# EAGLE design schematic (EAGLE 6.5.0)
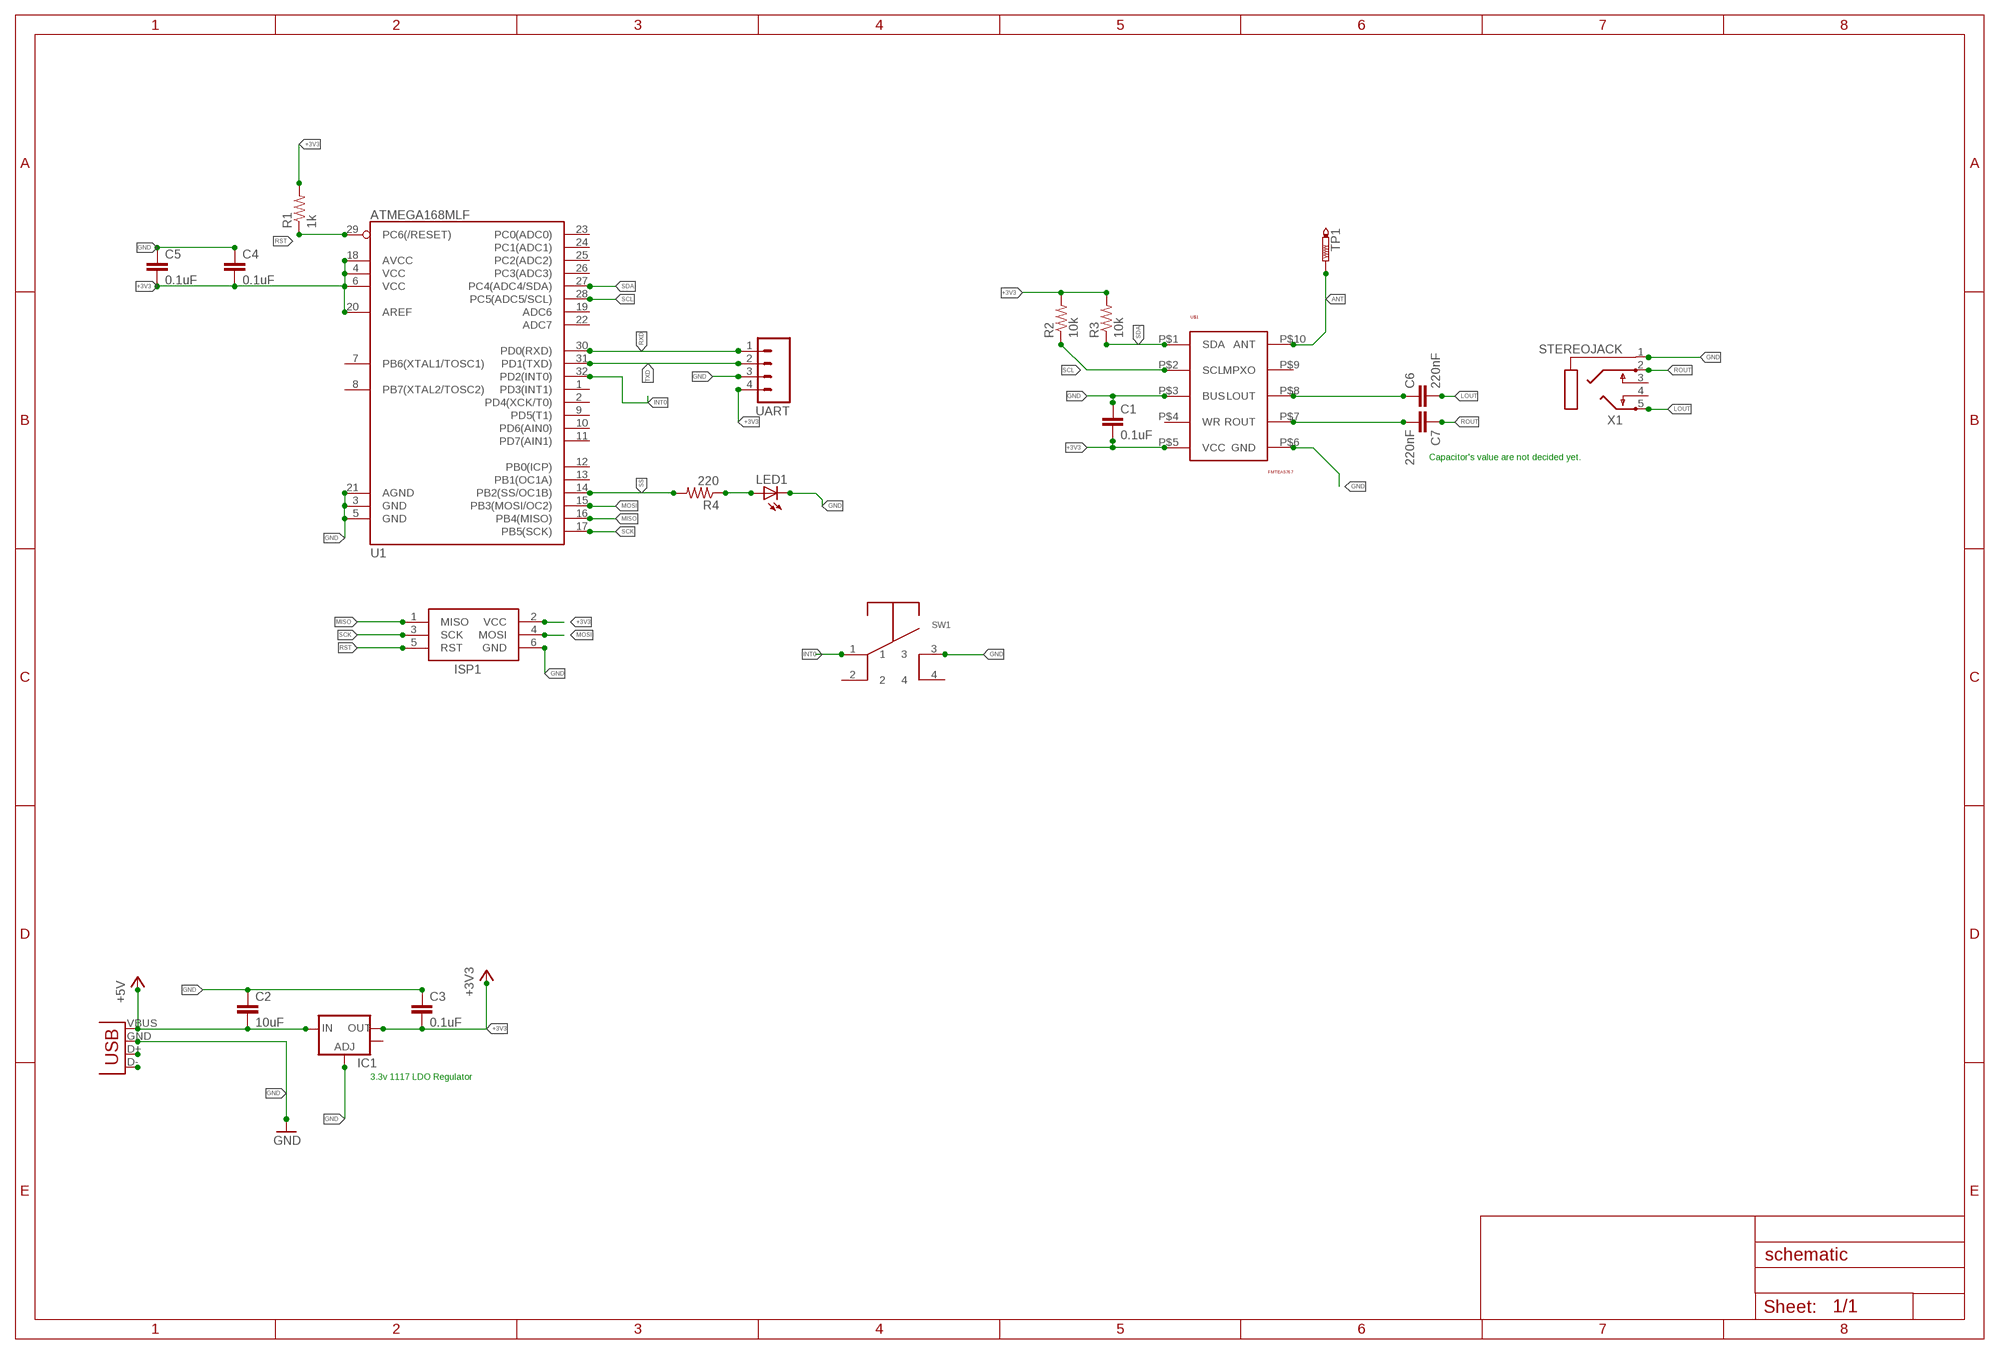
[diagram p0: schematic, sheet 1]

## Parts
C1  0.1uF  CAP0402-CAP  [0402-CAP]
C2  10uF  CAP0402-CAP  [0402-CAP]
C3  0.1uF  CAP0402-CAP  [0402-CAP]
C4  0.1uF  CAP0402-CAP  [0402-CAP]
C5  0.1uF  CAP0402-CAP  [0402-CAP]
C6  220nF  CAP0402-CAP  [0402-CAP]
C7  220nF  CAP0402-CAP  [0402-CAP]
IC1  V_REG_LM1117SOT223  [SOT223]
ISP1  AVRISP-6  [AVRISP]
JP1  USB-A-H  [USB-A-H]
LED1  LEDCHIPLED_0603  [CHIPLED_0603]
R1  1k  RESISTOR0402-RES  [0402-RES]
R2  10k  RESISTOR0402-RES  [0402-RES]
R3  10k  RESISTOR0402-RES  [0402-RES]
R4  220  RESISTOR0402-RES  [0402-RES]
SW1  TAC-SOFT  [SWITCH_SMD]
TP1  PTR1TP20SQ  [TP20SQ]
U1  ATMEGA168MLF  [MLF32]
U$1  FMTEA5767  [FMTEA5767]
UART  M04PTH  [1X04]
X1  STEREOJACK  [STX3100]

## Nets
+3V3 [PWR]: C1.2 C3.2 C4.2 C5.2 IC1.2(OUT) ISP1.2(VCC) R1.2 R2.2 R3.2 U1.4(VCC) U1.6(VCC) U1.18(AVCC) U1.20(AREF) U$1.P$5(VCC) UART.4
+5V: C2.2 IC1.3(IN) JP1.VBUS(GND)
ANT: TP1.TP U$1.P$10(ANT)
GND [PWR]: C1.1 C2.1 C3.1 C4.1 C5.1 IC1.1(ADJ) ISP1.6(GND) JP1.GND(VBUS) LED1.C SW1.3 U1.3(GND) U1.5(GND) U1.21(AGND) U$1.P$3(BUS) U$1.P$6(GND) UART.3 X1.1
INT0: SW1.1 U1.32(PD2(INT0))
LOUT: C6.2 X1.5
MISO: ISP1.1(MISO) U1.16(PB4(MISO))
MOSI: ISP1.4(MOSI) U1.15(PB3(MOSI/OC2))
N$1: JP1.D-(D+)
N$2: JP1.D+(D-)
N$4: C6.1 U$1.P$8(LOUT)
N$5: LED1.A R4.1
N$8: C7.2 U$1.P$7(ROUT)
ROUT: C7.1 X1.2
RST: ISP1.5(RST) R1.1 U1.29(PC6(/RESET))
RXD: U1.30(PD0(RXD)) UART.1
SCK: ISP1.3(SCK) U1.17(PB5(SCK))
SCL: R2.1 U1.28(PC5(ADC5/SCL)) U$1.P$2(SCL)
SDA: R3.1 U1.27(PC4(ADC4/SDA)) U$1.P$1(SDA)
SS: R4.2 U1.14(PB2(SS/OC1B))
TXD: U1.31(PD1(TXD)) UART.2
Unconnected: IC1.4(OUT) SW1.2 SW1.4 U1.1(PD3(INT1)) U1.2(PD4(XCK/T0)) U1.7(PB6(XTAL1/TOSC1)) U1.8(PB7(XTAL2/TOSC2)) U1.9(PD5(T1)) U1.10(PD6(AIN0)) U1.11(PD7(AIN1)) U1.12(PB0(ICP)) U1.13(PB1(OC1A)) U1.19(ADC6) U1.22(ADC7) U1.23(PC0(ADC0)) U1.24(PC1(ADC1)) U1.25(PC2(ADC2)) U1.26(PC3(ADC3)) U$1.P$4(WR) U$1.P$9(MPXO) X1.3 X1.4

## Notes on the sheet
- Capacitor's value are not decided yet.
- 3.3v 1117 LDO Regulator

## Library data of the parts
C1-C7 = weatherpilot_lbr:CAP: Capacitor Standard 0603 ceramic capacitor, and 0.1" leaded capacitor.
IC1 = SparkFun-PowerIC:V_REG_LM1117: Voltage Regulator LM1117 Standard adjustable voltage regulator but in SMD form. Spark Fun Electronics SKU : COM-00595
ISP1 = adafruit:AVRISP: AVR ISP HEADER Standard 6 pin header for AVR programming
JP1 = SparkFun-Connectors:USB: USB Connectors USB-B-PTH is fully proven SKU : PRT-00139/CONN-08278 USB-miniB is fully proven SKU : PRT-00587 USB-A-PCB is untested. USB-A-H is throughly reviewed, but untested. Spark Fun Electronics SKU : PRT-00437 USB-B-SMT is throughly reviewed, but untested. Needs silkscreen touching up. USB-A-S has not been used/tested USB-MB-H has not been used/tested USB-MICROB has been used. CONN-09505
LED1 = led:LED: LED OSRAM: - CHIPLED LG R971, LG N971, LY N971, LG Q971, LY Q971, LO R971, LY R971 LH N974, LH R974 LS Q976, LO Q976, LY Q976 LO Q996 - Hyper CHIPLED LW Q18S LB Q993, LB Q99A, LB R99A - SideLED LS A670, LO A670, LY A670, LG A670, LP A670 LB A673, LV A673, LT A673, LW A673 LH A674 LY A675 LS A676, LA A676, LO A676, LY A676, LW A676 LS A679, LY A679, LG A679 - Hyper Micro SIDELED® LS Y876, LA Y876, LO Y876, LY Y876 LT Y87S - SmartLED LW L88C, LW L88S LB L89C, LB L89S, LG L890 LS L89K, LO L89K, LY L89K LS L896, LA L896, LO L896, LY L896 - TOPLED LS T670, LO T670, LY T670, LG T670, LP T670 LSG T670, LSP T670, LSY T670, LOP T670, LYG T670 LG T671, LOG T671, LSG T671 LB T673, LV T673, LT T673, LW T673 LH T674 LS T676, LA T676, LO T676, LY T676, LB T676, LH T676, LSB T676, LW T676 LB T67C, LV T67C, LT T67C, LS T67K, LO T67K, LY T67K, LW E67C LS E67B, LA E67B, LO E67B, LY E67B, LB E67C, LV E67C, LT E67C LW T67C LS T679, LY T679, LG T679 LS T770, LO T770, LY T770, LG T770, LP T770 LB T773, LV T773, LT T773, LW T773 LH T774 LS E675, LA E675, LY E675, LS T675 LS T776, LA T776, LO T776, LY T776, LB T776 LHGB T686 LT T68C, LB T68C - Hyper Mini TOPLED® LB M676 - Mini TOPLED Santana® LG M470 LS M47K, LO M47K, LY M47K Source: http://www.osram.convergy.de LUXEON: - LUMILED® LXK2-PW12-R00, LXK2-PW12-S00, LXK2-PW14-U00, LXK2-PW14-V00 LXK2-PM12-R00, LXK2-PM12-S00, LXK2-PM14-U00 LXK2-PE12-Q00, LXK2-PE12-R00, LXK2-PE12-S00, LXK2-PE14-T00, LXK2-PE14-U00 LXK2-PB12-K00, LXK2-PB12-L00, LXK2-PB12-M00, LXK2-PB14-N00, LXK2-PB14-P00, LXK2-PB14-Q00 LXK2-PR12-L00, LXK2-PR12-M00, LXK2-PR14-Q00, LXK2-PR14-R00 LXK2-PD12-Q00, LXK2-PD12-R00, LXK2-PD12-S00 LXK2-PH12-R00, LXK2-PH12-S00 LXK2-PL12-P00, LXK2-PL12-Q00, LXK2-PL12-R00 Source: www.luxeon.com KINGBRIGHT: KA-3528ASYC Source: www.kingbright.com
R1-R4 = weatherpilot_lbr:RESISTOR: Resistor Basic schematic elements and footprints for 0603, 1206, and PTH resistors.
SW1 = libraryPart:TAC-SOFT: Soft Switch P12932SCT-ND
TP1 = testpad:PTR1: TEST PIN
U1 = SparkFun-DigitalIC:ATMEGA168: Atmel 32-pin 8-bit micro, 16k flash.
U$1 = library:FMTEA5767
UART = SparkFun-Connectors:M04: Header 4 Standard 4-pin 0.1" header. Use with straight break away headers (SKU : PRT-00116), right angle break away headers (PRT-00553), swiss pins (PRT-00743), machine pins (PRT-00117), and female headers (PRT-00115). Molex polarized connector foot print use with SKU : PRT-08231 with associated crimp pins and housings. 1MM SMD Version SKU: PRT-10208
X1 = adafruit:STEREOJACK: MIC/HEADPHONE JACK Stereo jack with two switches. Kycon STX3100, CUI SJ1-3555NG and/or 4UCon 05544

## Net classes
0 default: width 0.152 mm, drill 0.305 mm, clearance 0.152 mm
1 PWR: width 0.203 mm, drill 0.305 mm, clearance 0.152 mm

## Board
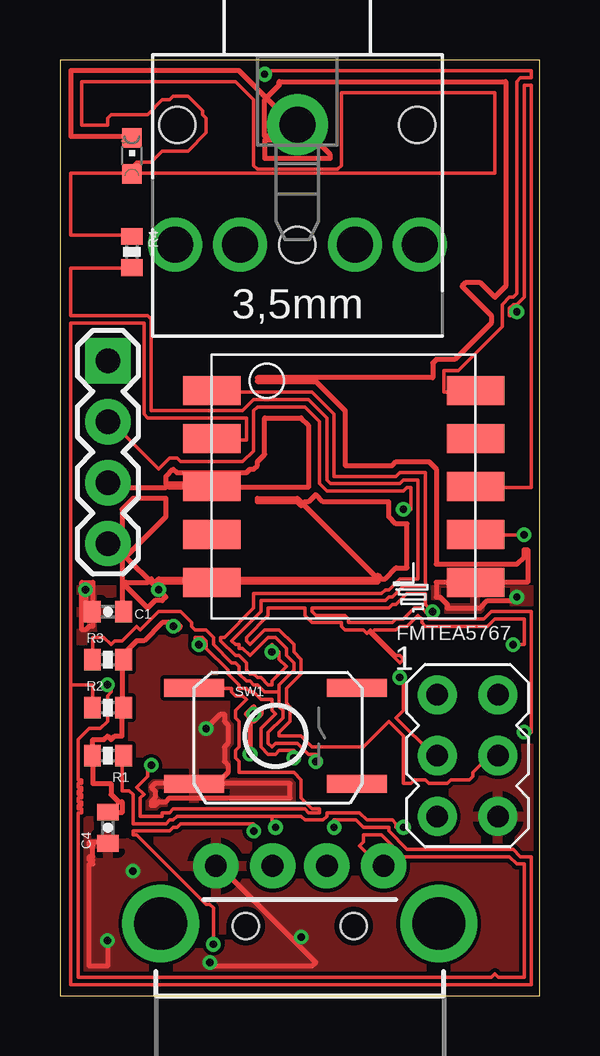
[diagram p1: board, top side]
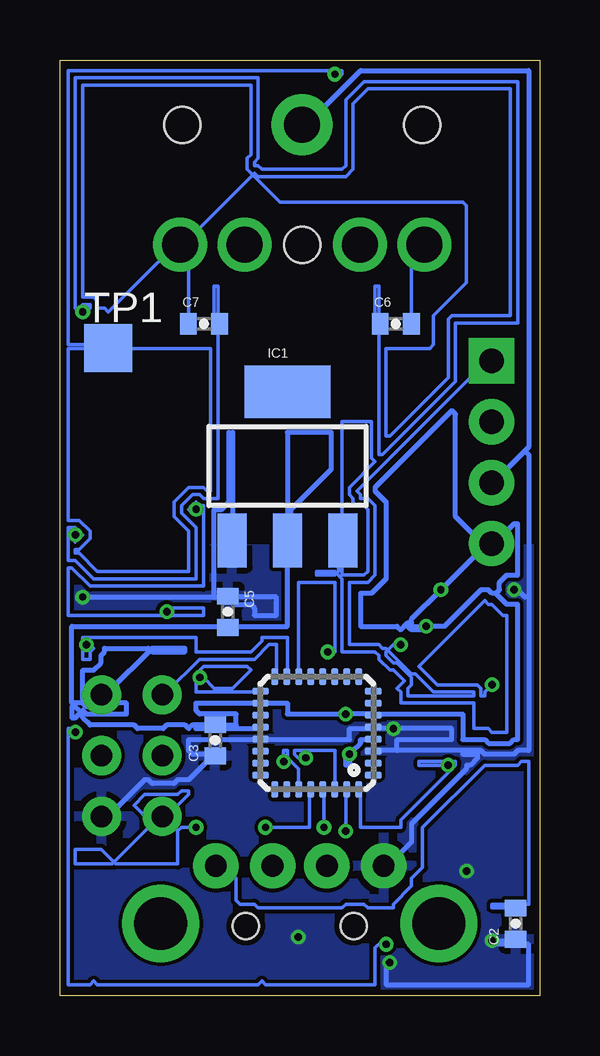
[diagram p2: board, bottom side, seen from below]

Size 20 x 39 mm. Coordinates in mm from the lower left corner, seen from the top.
Outline: 0,0 20,0 20,39 0,39 0,0
Copper layers (1*16): Top 0.035mm / dielectric 1.5mm / Bottom 0.035mm
Design rules "smart prototyping": minimum track width 6mil, minimum drill 12mil, track to track 6mil, track to pad 6mil, pad to pad 6mil, via to via 6mil, smd to smd 0mil, copper to edge 10mil, drill to drill 10mil, minimum pad ring 6mil, minimum via ring 6mil, stop-mask expansion 2mil, vias tented up to drill 25mil, thermal gap 10mil

### Footprints (pad centres in the part's own frame; a part is rotated, then mirrored left to right if it is on the bottom)
0402-CAP = smd 0.7 x 0.9: 1 -0.65,0; 2 0.65,0
SOT223 = smd 1.219 x 2.235: 1 -2.311,-3.099; 2 0,-3.099; 3 2.311,-3.099 | smd 3.6 x 2.2: 4 0,3.099
AVRISP = drill 0.9 pad 1.626: 1 -1.27,2.54; 2 1.27,2.54; 3 -1.27,0; 4 1.27,0; 5 -1.27,-2.54; 6 1.27,-2.54
USB-A-H = drill 0.914 pad 1.88: D+ 2.4,1.127; D- 2.4,-1.127; GND 2.4,3.5; VBUS 2.4,-3.5 | drill 2.2: GND2 0,-5.8; GND3 0,5.8 | hole 1.1: -0.1,2.25; -0.1,-2.25
CHIPLED_0603 = smd 0.8 x 0.8: A 0,-0.75; C 0,0.75
0402-RES = smd 0.7 x 0.9: 1 -0.65,0; 2 0.65,0
SWITCH_SMD = smd 2.5 x 0.762: 1 -3.4,2; 2 3.4,2; 3 -3.4,-2; 4 3.4,-2
TP20SQ = smd 2 x 2: TP 0,0
MLF32 = smd 0.7 x 0.3: 1 -2.35,1.75; 2 -2.35,1.25; 3 -2.35,0.75; 4 -2.35,0.25; 5 -2.35,-0.25; 6 -2.35,-0.75; 7 -2.35,-1.25; 8 -2.35,-1.75; 17 2.35,-1.75; 18 2.35,-1.25; 19 2.35,-0.75; 20 2.35,-0.25; 21 2.35,0.25; 22 2.35,0.75; 23 2.35,1.25; 24 2.35,1.75 | smd 0.3 x 0.7: 9 -1.75,-2.35; 10 -1.25,-2.35; 11 -0.75,-2.35; 12 -0.25,-2.35; 13 0.25,-2.35; 14 0.75,-2.35; 15 1.25,-2.35; 16 1.75,-2.35; 25 1.75,2.35; 26 1.25,2.35; 27 0.75,2.35; 28 0.25,2.35; 29 -0.25,2.35; 30 -0.75,2.35; 31 -1.25,2.35; 32 -1.75,2.35
FMTEA5767 = smd 2.4 x 1.2: P$1 0,-1.5; P$2 0,-3.5; P$3 0,-5.5; P$4 0,-7.5; P$5 0,-9.5; P$6 11,-9.5; P$7 11,-7.5; P$8 11,-5.5; P$9 11,-3.5; P$10 11,-1.5
1X04 = drill 1.016 pad 1.88 square: 1 0,0 | drill 1.016 pad 1.88: 2 2.54,0; 3 5.08,0; 4 7.62,0
STX3100 = drill 1.5 pad 2.54: 1 2.7,-0.1 | drill 1.5: 2 7.7,5; 3 7.7,2.3; 4 7.7,-2.5; 5 7.7,-5.2 | hole 1.5: 2.7,4.9; 2.7,-5.1; 7.7,-0.1

### Placement (x,y rotation side)
C1  2,16 0 top
C2  1,3 90 bottom
C3  13.52,10.64 90 bottom
C4  2,7 90 top
C5  13,16 270 bottom
C6  6,28 0 bottom
C7  14,28 0 bottom
IC1  10.51,22.07 0 bottom
ISP1  17,10 0 top
JP1  10,3 90 top
LED1  3,35 0 top
R1  2,10 180 top
R2  2,12 0 top
R3  2,14 0 top
R4  3,31 270 top
SW1  8.99,10.82 0 top
TP1  18,27 0 bottom
U1  9.29,10.95 180 bottom
U$1  6.33,26.72 0 top
UART  2,26.46 270 top
X1  10,39 270 top

### Tracks (layer width: path | path; a pad name or v marks a point on that pad's centre or on a via)
+3V3  (via drill 0.3)
  Top 0.203: C1.2 2.59,16 2.59,20.27 3.05,20.73 4.42,20.73 4.42,19.96 2.74,18.29 3.96,17.07 4.12,17.22 6.25,17.22 U$1.P$5 6.4,17.22 13.26,17.22 13.26,17.37 9.91,20.73 8.23,20.73 8.23,20.57 9.91,20.57 10.06,20.42 10.21,20.57 10.36,20.57 10.67,20.88 10.97,20.57 13.72,20.57 13.72,19.96 14.02,19.66 14.48,19.66 14.48,17.83 14.02,17.83 13.56,17.37 13.41,17.37 13.26,17.53 13.11,17.37 4.12,17.37 3.96,17.22 3.81,17.37 3.66,17.22 2.74,17.22 2.74,17.07 3.66,16.15 3.96,16.46 4.27,16.46 4.42,16.61 v4.12,16.92 | C4.2 2.13,7.62 2.59,7.62 2.59,8.08 2.44,8.08 2.13,8.38 2.13,8.84 1.37,8.84 1.37,9.91 R1.2 1.37,10.06 1.37,10.67 1.83,10.67 1.98,10.82 2.13,10.67 2.29,10.82 2.59,10.82 2.59,11.89 R2.2 2.59,12.04 2.59,13.87 R3.2 2.59,14.02 2.59,14.33 2.74,14.33 3.2,14.78 3.5,14.78 4.27,15.54 4.88,15.54 5.03,15.39 4.88,15.24 v4.72,15.39 | v7.92,10.06 7.92,11.43 8.08,11.43 8.38,11.73 8.38,11.89 8.23,11.89 8.08,12.04 7.77,11.73 7.92,11.58 v8.08,11.73
  Bottom 0.203: IC1.2 10.52,19.05 10.52,23.47 8.69,23.47 8.69,21.95 10.36,20.27 10.36,19.2 10.21,19.05 10.21,18.9 10.36,18.75 10.52,18.75 10.52,15.39 12.95,15.39 C5.2 13.11,15.39 19.51,15.39 19.51,12.19 19.05,12.19 18.9,12.04 18.44,12.5 18.29,12.5 ISP1.2 18.14,12.65 17.98,12.65 16.15,14.48 14.78,14.48 14.78,14.33 16.15,14.33 16.31,14.48 18.14,14.48 18.14,14.33 18.29,14.17 18.29,13.87 18.59,13.56 19.05,13.56 19.05,12.34 18.9,12.19 18.75,12.34 18.59,12.19 17.22,12.19 17.22,11.73 18.9,11.73 19.05,11.89 19.36,11.58 19.51,11.58 19.51,12.04 19.36,12.04 19.05,11.73 19.05,11.58 18.75,11.28 16.92,11.28 16.76,11.12 15.7,11.12 15.54,11.28 14.78,11.28 14.63,11.12 14.48,11.28 14.33,11.28 | v7.92,10.06 7.92,9.6 8.08,9.6 8.08,10.21 7.77,10.21 7.47,10.52 7.47,10.67 7.01,10.67 U1.4 | 14.33,11.28 14.33,11.12 11.73,11.12 U1.20 | 14.33,11.28 13.56,11.28 C3.2 13.41,11.28 12.65,11.28 12.65,11.73 14.17,11.73 14.33,11.89 14.33,12.19 11.73,12.19 U1.18 11.58,12.19 10.52,12.19 10.52,11.73 v8.08,11.73 7.01,11.73 U1.6 6.86,11.73 3.2,11.73 3.2,10.67 2.29,10.67 2.13,10.52 1.22,10.52 1.07,10.67 0.91,10.67 0.91,16.31 1.37,16.31 1.83,16.76 | v4.72,15.39 5.33,15.39 5.49,15.54 5.79,15.24 5.94,15.39 7.47,15.39 7.47,16.76 7.01,16.76 6.4,17.37 6.4,20.57 6.86,21.03 6.86,21.18 3.66,24.38 3.5,24.23 3.5,19.96 2.29,18.75 v4.12,16.92 5.33,15.7 5.33,15.54 5.49,15.39 5.33,15.24 4.72,15.24 4.57,15.39 3.96,15.39 2.44,16.92 2.13,16.92 1.98,16.76 1.83,16.76 | 1.83,16.76 1.68,16.92 1.68,17.22 1.37,17.53 0.91,17.53 0.91,19.66 1.07,19.66 1.83,18.9 1.98,18.9 UART.4
+5V  (via drill 0.3)
  Top 0.152: v1.98,12.95 2.13,12.8 2.13,12.65 1.98,12.5 1.98,11.43 1.68,11.12 1.22,11.12 0.76,10.67 0.76,8.99 0.91,8.99 0.91,8.84 0.76,8.84 0.76,8.69 0.91,8.69 0.91,8.53 0.76,8.53 0.76,8.38 0.91,8.38 0.91,8.23 0.76,8.23 0.76,8.08 0.91,8.08 0.91,7.92 0.76,7.92 0.76,7.77 0.91,7.77 0.91,7.62 0.76,7.62 0.76,0.76 17.98,0.76 18.14,0.91 18.29,0.76 19.36,0.76 19.36,5.49 19.05,5.49 18.75,5.79 14.33,5.79 13.41,6.71 12.65,6.71 12.65,6.4 12.5,6.25 13.26,5.49 13.41,5.49 JP1.VBUS
  Bottom 0.152: C2.2 1.07,3.66 1.98,3.66 1.98,3.81 0.46,3.81 0.46,9.75 0.76,9.75 0.91,9.6 2.29,9.6 4.88,7.01 4.88,5.33 5.33,4.88 5.33,4.57 6.1,3.81 6.1,3.66 7.16,3.66 7.32,3.81 8.08,3.81 8.23,3.66 11.73,3.66 11.89,3.81 12.5,3.81 12.65,3.96 12.65,4.88 13.26,5.49 13.41,5.49 JP1.VBUS | v1.98,12.95 2.29,12.65 2.29,12.5 2.44,12.5 2.44,12.8 2.59,12.95 4.27,12.95 5.03,13.72 2.29,16.46 2.13,16.31 1.98,16.31 1.52,15.85 1.37,15.85 1.37,10.97 1.98,10.97 2.13,11.12 2.74,11.12 2.74,12.19 5.79,12.19 5.79,12.65 5.94,12.8 5.64,13.11 6.1,13.56 6.25,13.56 6.71,14.02 6.71,14.17 6.86,14.33 8.23,14.33 8.23,17.37 8.53,17.68 9.3,17.68 9.3,17.53 8.53,17.53 8.38,17.68 8.38,18.75 8.23,18.75 8.23,17.53 7.32,17.53 7.16,17.68 7.16,20.27 7.32,20.42 7.62,20.42 7.77,20.57 7.77,20.73 7.92,20.88 7.92,21.18 6.86,22.25 7.01,22.4 7.01,23.93 8.23,23.93 8.23,19.05 IC1.3
ANT  (via drill 0.3)
  Top 0.152: v8.53,38.41 8.53,38.56 19.66,38.56 19.66,38.25 19.2,38.25 19.05,38.1 19.05,29.26 18.9,29.11 18.75,29.11 18.44,28.8 18.44,27.89 16.61,26.06 16,26.06 16,25.15 17.22,25.15 U$1.P$10
  Bottom 0.152: v8.53,38.41 8.38,38.25 8.23,38.41 8.23,38.56 19.66,38.56 19.66,27.13 18.29,27.13 18.29,26.98 19.66,26.98 19.66,19.81 19.2,19.81 18.75,19.36 18.75,19.05 19.2,18.59 19.36,18.59 19.36,18.44 19.2,18.44 18.44,17.68 14.63,17.68 14.63,19.36 15.24,19.96 15.24,20.57 14.63,21.18 14.02,21.18 13.87,21.03 13.72,21.03 13.72,26.98 17.98,26.98 TP1.TP
GND  (via drill 0.3)
  Top 0.203: v6.25,1.37 6.4,1.22 10.52,1.22 10.67,1.37 6.71,5.33 6.55,5.33 JP1.GND | v1.98,2.29 1.98,1.22 1.22,1.22 1.22,5.49 1.37,5.49 1.37,5.64 1.22,5.64 1.22,5.79 1.37,5.79 1.37,6.25 1.22,6.25 1.22,6.4 1.98,6.4 C4.1 | U$1.P$3 6.4,21.18 10.36,21.18 10.36,23.77 10.06,24.08 8.53,24.08 8.53,22.55 8.23,22.25 8.23,22.1 8.08,21.95 7.92,21.95 7.77,21.79 4.88,21.79 4.72,21.95 4.42,21.64 4.42,21.34 4.57,21.18 6.1,21.18 6.1,21.34 4.57,21.34 4.42,21.18 2.74,21.18 2.59,21.03 2.29,21.34 2.13,21.34 UART.3 | v19.05,16.61 19.05,16.46 17.83,16.46 17.53,16.15 16.15,16.15 16.15,16.31 15.85,16.61 15.7,16.61 15.7,17.22 17.22,17.22 U$1.P$6 17.37,17.22 19.51,17.22 19.51,18.59 19.36,18.59 19.36,18.29 19.05,17.98 15.7,17.98 15.7,21.95 15.39,22.25 14.02,22.25 13.87,22.1 11.89,22.1 11.89,24.38 10.67,25.6 8.23,25.6 8.23,25.76 15.54,25.76 15.54,26.36 15.7,26.52 16.46,26.52 17.98,28.04 17.98,28.35 16.76,29.57 16.92,29.72 17.53,29.72 18.14,29.11 18.59,29.57 18.59,38.1 9.14,38.1 9.14,37.95 8.53,37.34 8.53,35.81 10.21,35.81 10.36,35.97 11.28,35.05 11.28,34.9 8.53,34.9 8.53,35.66 10.21,35.66 10.36,35.81 10.21,35.97 10.21,36.12 10.06,36.27 9.91,36.27 X1.1 9.75,36.42 9.6,36.42 7.47,38.56 0.46,38.56 0.46,35.81 2.9,35.81 LED1.C | v1.07,16.92 1.07,15.85 1.22,15.7 1.37,15.7 1.37,15.39 1.22,15.39 1.07,15.24 0.91,15.24 0.91,17.22 1.37,17.22 1.37,16 C1.1 | v6.1,11.12 6.71,11.73 6.86,11.73 6.86,11.43 7.01,11.28 7.01,10.52 6.86,10.36 6.86,9.75 7.01,9.6 7.01,9.3 6.71,8.99 5.49,8.99 5.33,8.84 3.96,8.84 3.81,8.69 3.96,8.53 3.96,8.23 3.81,8.08 3.81,7.92 3.96,7.92 4.12,8.08 4.42,8.08 4.57,8.23 9.6,8.23 9.6,8.84 5.64,8.84 SW1.3
  Bottom 0.203: ISP1.6 18.14,7.47 17.98,7.47 16.46,8.99 16.31,8.99 16.15,8.84 15.24,8.84 15.09,8.99 14.63,8.99 13.72,9.91 13.56,9.91 C3.1 13.56,10.06 14.48,10.06 14.63,10.21 14.63,10.67 11.73,10.67 U1.21 11.58,10.67 7.92,10.67 7.92,11.12 7.01,11.12 U1.5 6.86,11.12 v6.1,11.12 3.66,11.12 3.66,10.67 5.94,10.67 5.94,10.21 | v6.25,1.37 6.4,1.37 6.4,0.46 0.46,0.46 0.46,2.13 1.98,2.13 v1.98,2.29 1.07,2.29 C2.1 | v19.05,16.61 13.56,16.61 | 13.56,16.61 13.26,16.61 13.11,16.46 12.8,16.46 12.8,16.31 12.04,16.31 11.89,16.15 11.89,15.85 10.97,15.85 10.97,16.61 12.95,16.61 C5.1 | 13.56,16.61 13.56,20.27 13.26,20.27 12.95,20.57 12.95,23.47 12.8,23.47 12.8,19.05 IC1.1 | 3.2,10.21 2.44,10.21 2.29,10.06 1.07,10.06 0.91,10.21 0.46,10.21 0.46,16.61 | 3.2,10.21 5.94,10.21 | 5.94,10.21 6.86,10.21 U1.3 | 0.46,16.61 0.46,22.55 0.61,22.71 | 0.61,22.71 0.46,22.86 0.46,38.56 7.47,38.56 9.6,36.42 9.75,36.42 X1.1 | v1.07,16.92 1.07,16.76 0.76,16.76 0.61,16.61 0.46,16.61 | 0.61,22.71 1.83,21.49 1.98,21.49 UART.3 | 3.2,10.21 3.2,10.06 2.59,10.06 2.59,9.91 2.9,9.6 3.05,9.6 3.05,9.45 5.33,7.16 5.33,6.4 6.25,5.49 6.4,5.49 JP1.GND
  other vias: 3.05,5.18 10.06,2.44
  pour Top (isolate 0.152): -9.6,16.92 28.04,16.92 28.04,-2.29 -9.6,-2.29
  pour Bottom (isolate 0.152): -5.33,18.59 23.62,18.59 23.62,-1.37 -5.33,-1.37
INT0  (via drill 0.3)
  Top 0.152: v3.81,9.6 3.66,9.45 3.66,9.14 3.2,8.69 3.5,8.38 3.35,8.23 3.35,7.47 4.27,7.47 4.27,7.62 4.57,7.62 4.72,7.77 10.21,7.77 10.36,7.62 10.82,7.62 10.82,7.77 10.52,7.77 10.06,8.23 10.06,8.99 9.75,9.3 7.47,9.3 7.47,9.75 7.32,9.91 7.32,10.21 7.47,10.36 7.47,11.43 7.32,11.58 7.32,11.89 7.77,12.34 7.62,12.5 7.32,12.5 7.16,12.65 7.16,12.8 5.64,12.8 SW1.1
  Bottom 0.152: v3.81,9.6 5.03,9.6 5.03,9.75 3.5,9.75 3.5,9.6 5.79,7.32 5.79,7.01 7.47,7.01 7.47,8.53 U1.32
LOUT
  Bottom 0.152: C6.2 5.33,28.04 5.33,30.63 5.49,30.79 5.03,31.24 4.88,31.24 X1.5
MISO
  Bottom 0.152: U1.16 10.97,13.41 10.97,14.63 11.28,14.63 11.89,14.02 14.17,14.02 15.54,12.65 15.7,12.65 ISP1.1
MOSI  (via drill 0.3)
  Top 0.152: v18.9,14.63 19.36,14.63 19.36,15.7 18.14,15.7 17.83,15.39 15.24,15.39 15.09,15.54 15.09,15.7 14.94,15.85 14.48,15.39 14.17,15.39 14.02,15.24 13.11,15.24 12.95,15.09 14.17,13.87 14.33,14.02 14.17,14.17 14.02,14.17 12.95,15.24 12.8,15.09 12.65,15.24 11.89,15.24 11.73,15.39 11.73,15.54 10.52,15.54 10.21,15.85 10.21,16.15 8.69,16.15 8.69,15.85 7.77,14.94 7.77,14.78 7.92,14.63 8.53,15.24 9.14,15.24 9.75,14.63 9.75,14.33 10.06,14.02 10.06,13.41 9.45,12.8 9.45,12.19 9.6,12.04 9.6,11.43 9.14,10.97 9.14,10.82 10.06,10.82 10.52,10.36 12.65,10.36 13.72,11.43 14.33,10.82 14.33,8.84 14.63,8.84 14.78,8.99 15.24,8.99 15.39,8.84 16.15,8.84 16.31,8.99 17.07,8.99 17.22,9.14 17.22,9.3 17.98,10.06 18.14,10.06 ISP1.4
  Bottom 0.152: v18.9,14.63 18.75,14.63 18.59,14.48 18.75,14.33 18.75,14.02 19.05,14.02 19.05,14.94 14.33,14.94 14.33,14.33 12.04,14.33 11.58,14.78 11.58,14.94 10.52,14.94 10.52,13.41 U1.15
N$4  (via drill 0.3)
  Top 0.152: v19.05,28.5 18.9,28.35 18.75,28.35 18.75,28.65 18.9,28.8 19.05,28.8 19.36,29.11 19.36,37.95 19.66,37.95 19.66,21.18 17.37,21.18 U$1.P$8
  Bottom 0.152: v19.05,28.5 18.9,28.65 18.75,28.65 18.75,28.8 19.05,28.8 19.2,28.65 19.36,28.65 19.36,38.25 11.73,38.25 11.73,34.9 11.89,34.75 11.89,34.59 11.73,34.59 11.58,34.44 8.23,34.44 8.08,34.59 8.08,37.34 7.32,38.1 0.91,38.1 0.91,28.04 3.5,28.04 3.5,25.6 6.55,22.55 6.71,22.55 6.71,27.74 6.86,27.89 6.86,29.57 6.71,29.57 6.71,28.04 C6.1
N$5
  Top 0.152: LED1.A 3.05,34.29 18.14,34.29 18.14,37.64 11.73,37.64 11.73,34.59 11.58,34.44 8.23,34.44 8.08,34.59 8.08,37.34 7.32,38.1 0.91,38.1 0.91,36.27 1.98,36.27 1.98,36.58 2.13,36.73 3.66,36.73 4.27,37.34 4.57,37.34 4.72,37.49 5.33,37.49 5.94,36.88 5.94,36.73 6.1,36.58 6.1,35.97 5.33,35.2 4.27,35.2 3.81,34.75 3.2,34.75 2.74,34.29 0.46,34.29 0.46,31.7 2.9,31.7 R4.1
N$8  (via drill 0.3)
  Top 0.152: v19.36,19.2 17.37,19.2 U$1.P$7
  Bottom 0.152: v19.36,19.2 19.51,19.05 19.36,18.9 19.05,19.2 19.36,19.51 19.66,19.51 19.66,18.14 19.36,18.14 18.59,17.37 14.33,17.37 14.33,19.51 14.94,20.12 14.94,20.42 14.48,20.88 14.17,20.88 14.02,20.73 13.41,20.73 13.41,27.74 13.56,27.89 13.56,29.57 13.41,29.57 13.41,28.04 C7.2
ROUT
  Bottom 0.152: C7.1 14.63,28.04 14.63,31.24 14.78,31.39 11.89,34.29 11.73,34.14 8.08,34.14 7.77,34.44 7.77,37.19 7.16,37.8 1.22,37.8 1.22,28.35 3.66,28.35 3.81,28.19 3.81,25.76 6.25,23.32 6.4,23.32 6.4,26.98 4.57,26.98 4.42,27.13 4.42,28.35 3.05,29.72 3.05,32.92 3.2,33.07 10.82,33.07 12.19,34.44 12.19,34.9 12.04,35.05 12.04,37.95 19.05,37.95 19.05,29.11 18.59,29.11 18.44,28.96 18.44,28.65 18.14,28.65 17.98,28.5 15.24,31.24 15.09,31.24 X1.2
RST  (via drill 0.3)
  Top 0.152: v8.99,7.01 8.84,7.16 8.84,7.47 | 8.84,7.47 4.88,7.47 4.72,7.32 4.57,7.32 4.42,7.16 3.05,7.16 3.05,8.38 2.9,8.53 2.59,8.53 2.59,9.91 R1.1 | v14.33,7.01 14.02,7.01 14.02,7.16 13.87,7.32 12.8,7.32 12.5,7.62 11.12,7.62 11.12,7.47 10.97,7.32 10.21,7.32 10.06,7.47 8.84,7.47
  Bottom 0.152: v8.99,7.01 8.99,8.53 U1.29 | v14.33,7.01 14.94,7.01 15.09,6.86 15.09,5.49 17.68,5.49 18.29,6.1 19.36,6.1 19.36,5.49 17.83,5.49 16.15,7.16 16.92,7.92 16.46,8.38 15.09,8.38 14.94,8.53 14.63,8.53 14.63,8.38 15.54,7.47 15.7,7.47 ISP1.5
RXD  (via drill 0.3)
  Top 0.152: v9.75,9.91 9.91,10.06 9.75,10.21 9.14,10.21 8.99,10.06 8.69,10.06 8.38,10.36 8.38,11.12 8.99,11.73 8.84,11.89 8.84,12.34 8.38,12.34 8.08,12.65 7.92,12.65 7.77,12.8 7.47,12.8 7.47,12.95 7.01,13.41 7.01,13.56 6.1,14.48 6.1,14.78 5.94,14.94 5.64,14.94 5.64,14.78 v5.79,14.63
  Bottom 0.152: v9.75,9.91 9.91,9.75 10.21,10.06 10.21,10.21 8.53,10.21 8.53,8.69 U1.30 | v5.79,14.63 6.1,14.63 6.4,14.33 6.4,14.17 6.1,13.87 5.94,13.87 5.33,13.26 5.33,12.95 5.49,12.8 5.49,12.5 2.74,12.5 2.74,12.65 4.42,12.65 5.18,13.41 5.33,13.41 6.4,14.48 6.55,14.48 6.71,14.63 7.92,14.63 7.92,17.22 7.16,17.22 6.86,17.53 6.86,20.42 7.16,20.73 7.47,20.73 7.47,20.88 7.62,21.03 2.29,26.36 2.13,26.36 UART.1
SCK  (via drill 0.3)
  Top 0.152: v14.17,13.26 14.33,13.11 14.33,11.89 14.02,11.58 15.54,10.06 15.7,10.06 ISP1.3
  Bottom 0.152: v14.17,13.26 14.02,13.26 13.56,12.8 12.8,12.8 12.04,13.56 12.19,13.72 14.02,13.72 14.33,13.41 14.33,12.65 11.73,12.65 U1.17
SCL  (via drill 0.3)
  Top 0.152: v11.43,7.01 11.28,7.16 11.43,7.32 12.34,7.32 12.65,7.01 13.72,7.01 13.72,6.86 14.48,6.1 18.9,6.1 19.2,5.79 19.66,5.79 19.66,0.46 0.46,0.46 0.46,12.95 | 0.46,12.95 0.46,28.04 3.5,28.04 3.5,24.23 3.66,24.08 7.77,24.08 7.77,23.16 6.4,23.16 U$1.P$2 | 0.46,12.95 1.37,12.95 1.37,12.04 R2.1
  Bottom 0.152: v11.43,7.01 9.6,7.01 9.6,8.53 U1.28
SDA  (via drill 0.3)
  Top 0.152: v10.67,9.75 10.67,10.06 10.36,10.06 9.91,10.52 8.99,10.52 8.84,10.36 8.69,10.52 8.69,10.97 9.3,11.58 9.3,11.89 9.14,12.04 9.14,12.65 | 9.14,12.65 9.14,12.95 9.75,13.56 9.75,13.87 9.45,14.17 9.45,14.48 8.99,14.94 8.69,14.94 7.92,14.17 7.62,14.48 7.47,14.48 7.47,14.63 7.32,14.63 7.16,14.78 8.38,16 8.38,16.46 13.56,16.46 13.72,16.61 13.87,16.61 14.33,17.07 15.24,17.07 15.24,21.79 14.17,21.79 14.02,21.64 11.43,21.64 11.43,24.23 10.52,25.15 6.4,25.15 U$1.P$1 | 9.14,12.65 8.53,12.65 8.23,12.95 8.08,12.95 7.92,13.11 7.77,13.11 7.47,13.41 7.47,13.72 7.32,13.87 7.16,13.87 6.4,14.63 6.4,14.94 6.1,15.24 5.64,15.24 5.49,15.39 5.49,15.54 5.03,16 4.12,16 3.35,15.24 3.2,15.39 2.59,14.78 2.29,14.78 2.13,14.63 1.83,14.94 1.37,14.94 1.37,14.02 R3.1
  Bottom 0.152: v10.67,9.75 10.67,10.21 10.52,10.21 10.52,9.91 10.06,9.45 10.06,8.69 U1.27
SS  (via drill 0.3)
  Top 0.152: v8.84,14.33 8.69,14.48 8.84,14.63 9.14,14.33 9.14,14.02 9.45,13.72 8.84,13.11 8.84,12.95 8.69,12.95 8.38,13.26 8.23,13.26 8.08,13.41 7.92,13.41 7.77,13.56 7.77,13.87 7.47,14.17 7.32,14.17 6.71,14.78 6.71,14.94 6.86,14.94 8.08,16.15 8.08,16.76 13.41,16.76 13.56,16.92 13.72,16.92 14.17,17.37 14.94,17.37 14.94,21.49 14.33,21.49 14.17,21.34 11.28,21.34 11.12,21.49 11.12,24.08 10.36,24.84 8.08,24.84 7.62,24.38 3.81,24.38 3.81,28.19 3.66,28.35 0.46,28.35 0.46,30.33 2.9,30.33 R4.2
  Bottom 0.152: v8.84,14.33 8.53,14.33 8.53,17.22 10.06,17.22 10.06,13.41 U1.14
TXD  (via drill 0.3)
  Top 0.152: v8.08,6.86 8.08,7.16 5.03,7.16 4.88,7.01 4.72,7.01 4.57,6.86 3.05,6.86 3.05,6.71 3.2,6.71 6.1,3.81 6.25,3.81 6.4,3.66 v6.4,2.13 | v19.36,10.97 19.66,10.97 19.66,16 17.98,16 17.68,15.7 15.39,15.7 15.39,15.85 15.09,16.15 14.78,16.15 14.33,15.7 14.02,15.7 13.87,15.54 12.04,15.54 12.04,15.7 11.89,15.85 10.67,15.85 10.52,16 10.52,16.15 13.72,16.15 13.87,16.31 14.02,16.31 14.48,16.76 15.24,16.76 15.24,16.31 v15.54,16 | v14.33,20.27 14.63,20.27 14.63,21.18 14.48,21.18 14.33,21.03 11.12,21.03 10.82,21.34 10.82,23.93 10.21,24.54 8.23,24.54 8.08,24.38 8.08,22.71 7.62,22.25 5.03,22.25 4.88,22.4 4.57,22.4 4.12,21.95 2.29,23.77 2.13,23.77 UART.2
  Bottom 0.152: v8.08,6.86 8.08,8.53 U1.31 | v6.4,2.13 6.55,2.29 6.86,1.98 6.86,0.46 11.43,0.46 11.58,0.61 11.73,0.46 18.44,0.46 18.59,0.61 18.75,0.46 19.66,0.46 19.66,11.12 19.51,11.12 v19.36,10.97 | v15.54,16 15.54,16.15 14.02,16.15 14.02,15.85 19.66,15.85 19.66,17.83 19.51,17.83 18.75,17.07 14.02,17.07 14.02,20.42 14.17,20.42 14.33,20.57 14.63,20.27 14.48,20.12 v14.33,20.27